# EAGLE design Bottle_PCB (EAGLE 7.1.0)
Assembly variants: BOM_CHECKED
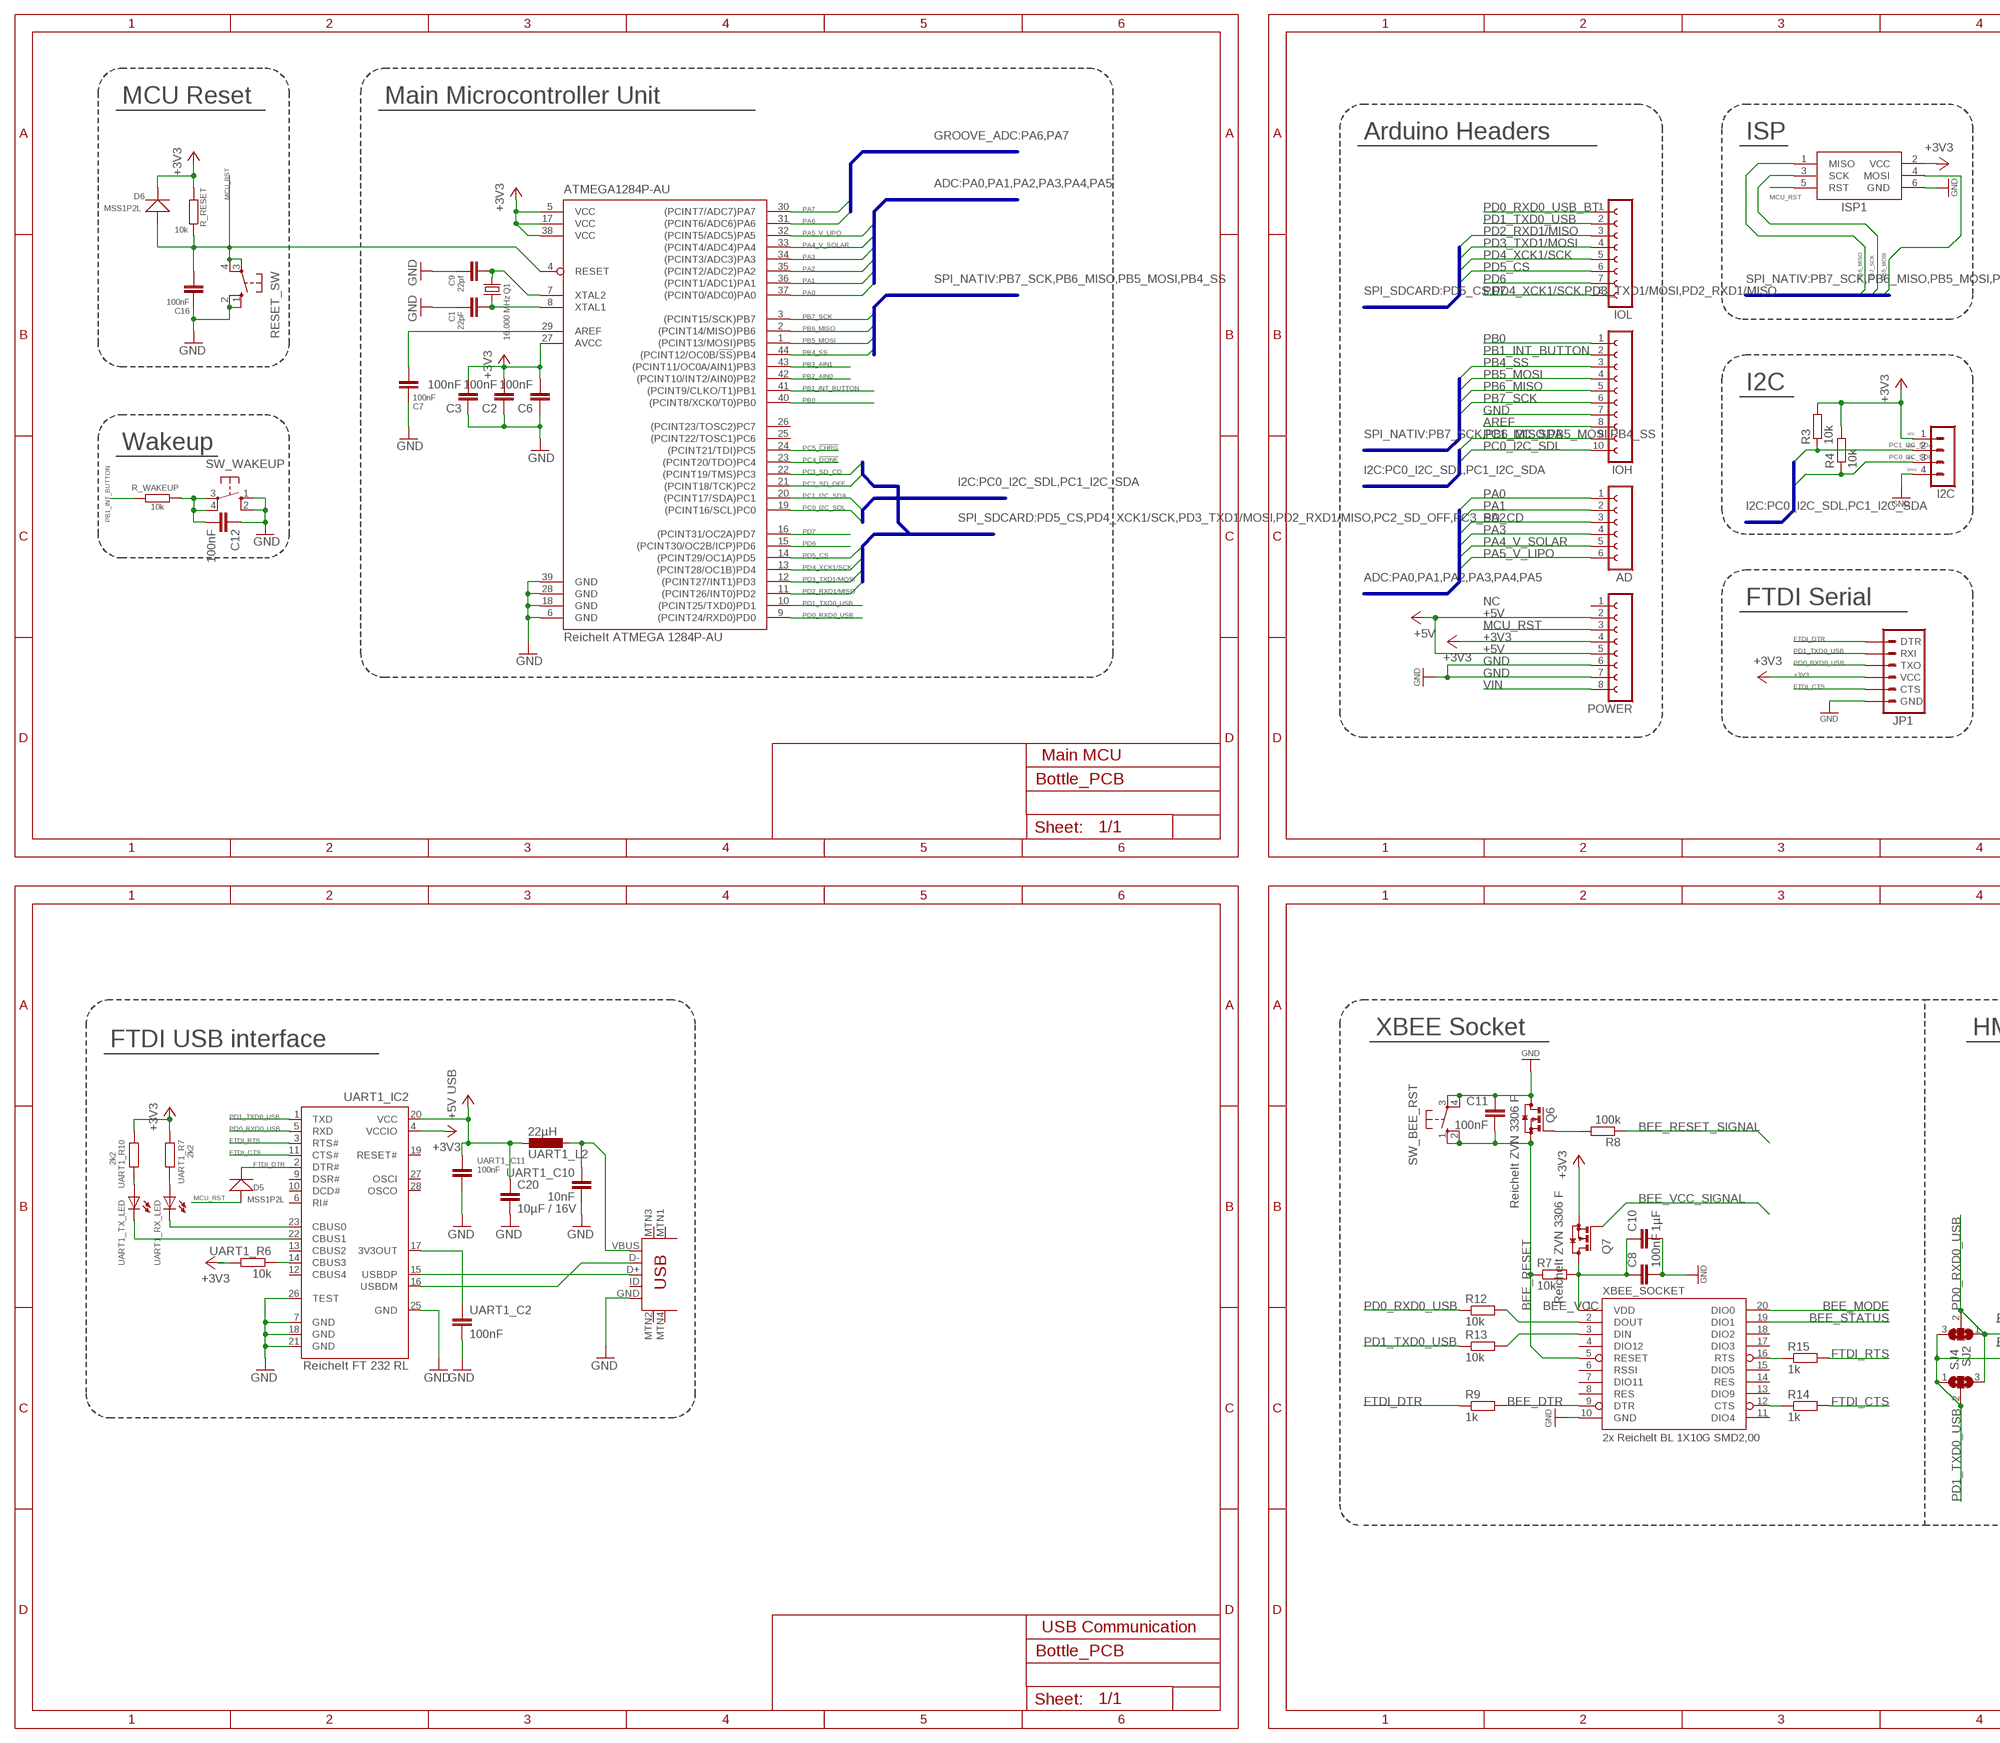
[diagram p0: schematic, sheet 1, part 1 of 2]
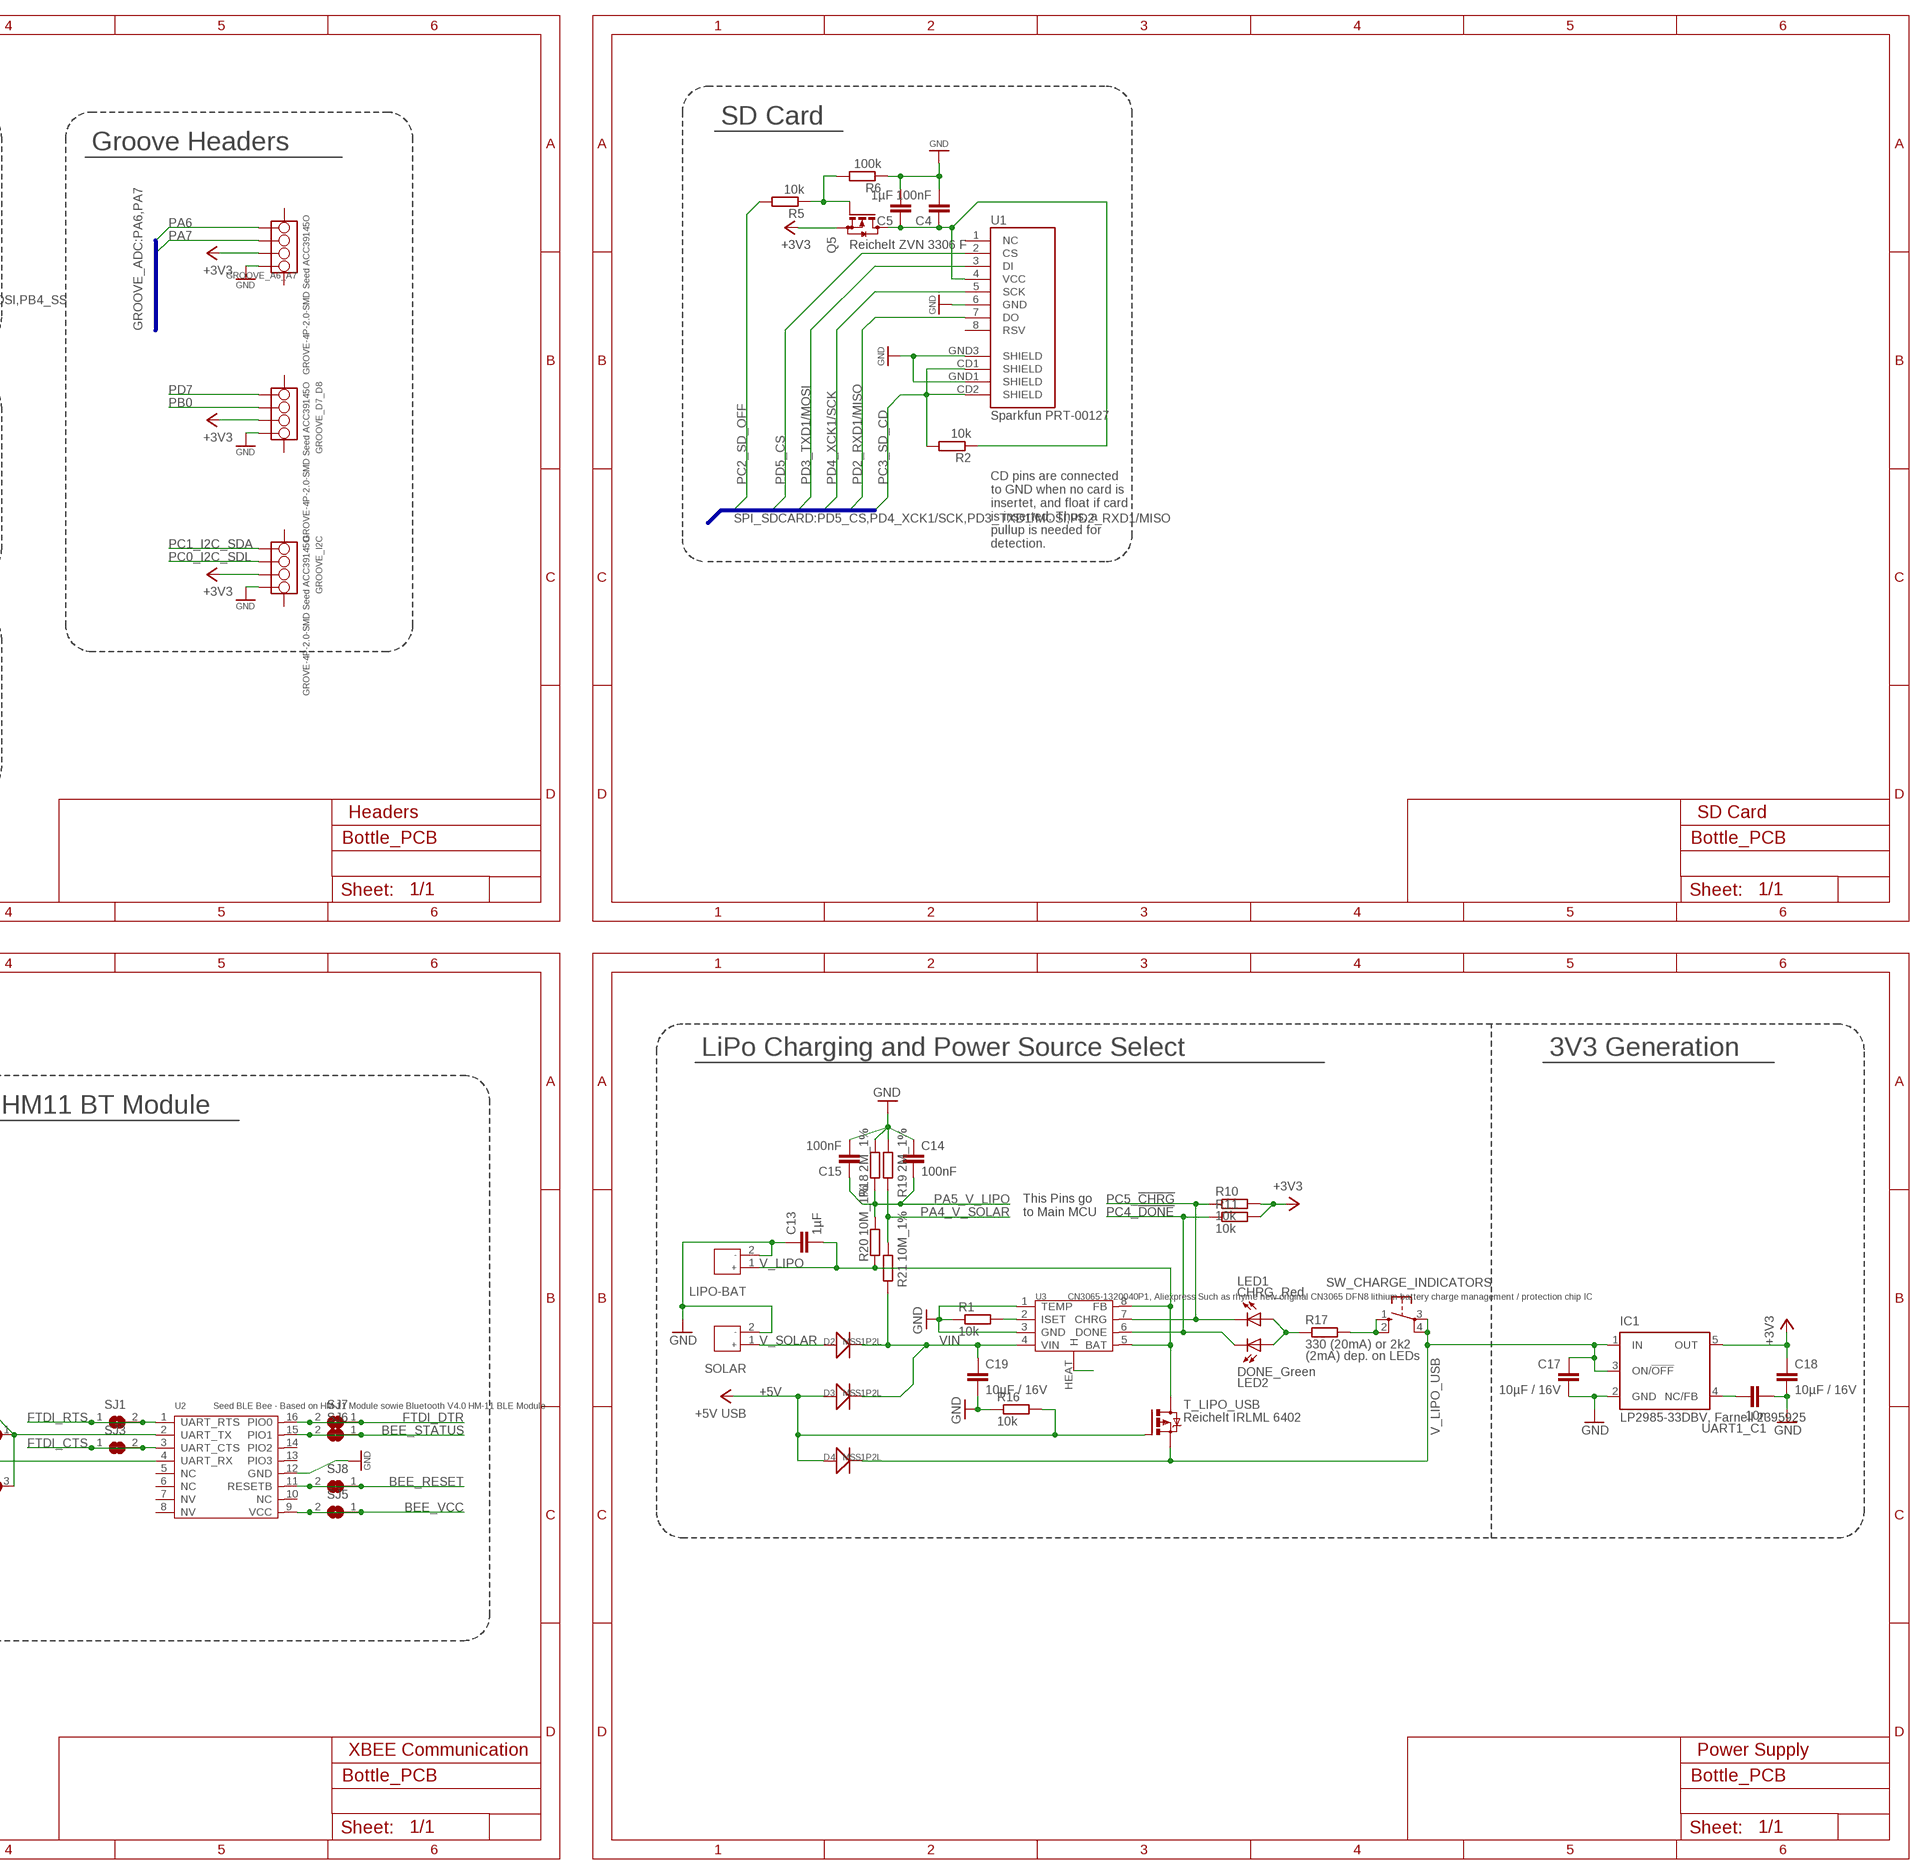
[diagram p1: schematic, sheet 1, part 2 of 2]

## Parts
AD  FE06-1  [FE06]  (variant BOM_CHECKED: Sparkfun PRT-11417 Part 1/4)
ATMEGA1284P-AU  Reichelt ATMEGA 1284P-AU  ATMEGA644A  [TQFP44]
C1  22pF  C-EUC0603  [C0603-ROUND]  (variant BOM_CHECKED: Reichelt NPO-G0603 22P)
C2  100nF  C-EUC0603  [C0603-ROUND]  (variant BOM_CHECKED: Reichelt X7R-G0603 100N)
C3  100nF  C-EUC0603  [C0603-ROUND]  (variant BOM_CHECKED: Reichelt X7R-G0603 100N)
C4  100nF  C-EUC0603  [C0603-ROUND]  (variant BOM_CHECKED: Reichelt X7R-G0603 100N)
C5  1µF  C-EUC1210  [C1210]  (variant BOM_CHECKED: Reichelt X7R-G1210 1,0)
C6  100nF  C-EUC0603  [C0603-ROUND]  (variant BOM_CHECKED: Reichelt X7R-G0603 100N)
C7  100nF  C-EUC0603  [C0603-ROUND]  (variant BOM_CHECKED: Reichelt X7R-G0603 100N)
C8  100nF  C-EUC0603  [C0603-ROUND]  (variant BOM_CHECKED: Reichelt X7R-G0603 100N)
C9  22pf  C-EUC0603  [C0603-ROUND]  (variant BOM_CHECKED: Reichelt NPO-G0603 22P)
C10  1µF  C-EUC1210  [C1210]  (variant BOM_CHECKED: Reichelt X7R-G1210 1,0)
C11  100nF  C-EUC0603  [C0603-ROUND]  (variant BOM_CHECKED: Reichelt X7R-G0603 100N)
C12  100nF  C-EUC0603  [C0603-ROUND]  (variant BOM_CHECKED: Reichelt X7R-G0603 100N)
C13  1µF  C-EUC1210  [C1210]  (variant BOM_CHECKED: Reichelt X7R-G1210 1,0)
C14  100nF  C-EUC0603  [C0603-ROUND]  (variant BOM_CHECKED: Reichelt X7R-G0603 100N)
C15  100nF  C-EUC0603  [C0603-ROUND]  (variant BOM_CHECKED: Reichelt X7R-G0603 100N)
C16  100nF  C-EUC0603  [C0603-ROUND]  (variant BOM_CHECKED: Reichelt X7R-G0603 100N)
C17  10µF / 16V  C-EUC0805  [C0805]  (variant BOM_CHECKED: Reichelt X5R-G0805 10/16)
C18  10µF / 16V  C-EUC0805  [C0805]  (variant BOM_CHECKED: Reichelt X5R-G0805 10/16)
C19  10µF / 16V  C-EUC0805  [C0805]  (variant BOM_CHECKED: Reichelt X5R-G0805 10/16)
C20  10µF / 16V  C-EUC0805  [C0805]  (variant BOM_CHECKED: Reichelt X5R-G0805 10/16)
D2  MSS1P2L  D1005  [D1005]  (variant BOM_CHECKED: DigiKey MSS1P2U)
D3  MSS1P2L  D1005  [D1005]  (variant BOM_CHECKED: DigiKey MSS1P2U)
D4  MSS1P2L  D1005  [D1005]  (variant BOM_CHECKED: DigiKey MSS1P2U)
D5  MSS1P2L  D1005  [D1005]  (variant BOM_CHECKED: DigiKey MSS1P2U)
D6  MSS1P2L  D1005  [D1005]  (variant BOM_CHECKED: DigiKey MSS1P2U)
GROOVE_A6_A7  GROVE-4P-2.0-SMD Seed ACC39145O  GROVE-4P-2.0-SMD-FEMALE-REINFORCE-3470090P1  [4P-SMD-2.0]
GROOVE_D7_D8  GROVE-4P-2.0-SMD Seed ACC39145O  GROVE-4P-2.0-SMD-FEMALE-REINFORCE-3470090P1  [4P-SMD-2.0]
GROOVE_I2C  GROVE-4P-2.0-SMD Seed ACC39145O  GROVE-4P-2.0-SMD-FEMALE-REINFORCE-3470090P1  [4P-SMD-2.0]
I2C  MA04-1  [MA04-1]  (variant BOM_CHECKED: Reichelt SL 1X36G 2,54, geteilt mit J1 reicht für jeweils 3 Boards)
IC1  LP2985-33DBV, Farnell 2395925  LP2985-XXDBVR33  [SOT23-DBV]
IOH  FE10-1  [FE10]  (variant BOM_CHECKED: Sparkfun PRT-11417 Part 2/4)
IOL  FE08-1  [FE08]  (variant BOM_CHECKED: Sparkfun PRT-11417 Part 3/4)
ISP1  Reichelt WSL 6G  AVRISP-6  [AVRISP]
JP1  ARDUINO_SERIAL_PROGRAMPTH  [1X06]  (variant BOM_CHECKED: siehe I2C)
LED1  CHRG_Red  LEDCHIPLED_0603  [CHIPLED_0603]  (variant BOM_CHECKED: Reichelt LS L29K)
LED2  DONE_Green  LEDCHIPLED_0603  [CHIPLED_0603]  (variant BOM_CHECKED: Reichelt LG L29K)
LIPO-BAT  JACK-JST-2P-PW2.0  [JST-2.0]  (variant BOM_CHECKED: Sparkfun PRT-00339 and Lipoly 2.5 mm JST XH-Style Shrouded Male Connector: 2-Pin, Straight (4-Pack) Pololu 2717)
POWER  FE08-1  [FE08]  (variant BOM_CHECKED: Sparkfun PRT-11417 Part 1/4)
Q1  16.000 MHz  CRYSTALHC49U-V  [HC49U-V]  (variant BOM_CHECKED: Reichelt 16,0000-HC49U-S)
Q5  Reichelt ZVN 3306 F  BSS123  [SOT23]
Q6  Reichelt ZVN 3306 F  BSS123  [SOT23]
Q7  Reichelt ZVN 3306 F  BSS123  [SOT23]
R1  10k  R-EU_R0603  [R0603-ROUND]  (variant BOM_CHECKED: Reichelt SMD-0603 10K)
R2  10k  R-EU_R0603  [R0603-ROUND]  (variant BOM_CHECKED: Reichelt SMD-0603 10K)
R3  10k  R-EU_R0603  [R0603-ROUND]  (variant BOM_CHECKED: Reichelt SMD-0603 10K)
R4  10k  R-EU_R0603  [R0603-ROUND]  (variant BOM_CHECKED: Reichelt SMD-0603 10K)
R5  10k  R-EU_R0603  [R0603-ROUND]  (variant BOM_CHECKED: Reichelt SMD-0603 10K)
R6  100k  R-EU_R0603  [R0603-ROUND]  (variant BOM_CHECKED: Reichelt SMD-0603 100K)
R7  10k  R-EU_R0603  [R0603-ROUND]  (variant BOM_CHECKED: Reichelt SMD-0603 10K)
R8  100k  R-EU_R0603  [R0603-ROUND]  (variant BOM_CHECKED: Reichelt SMD-0603 100K)
R9  1k  R-EU_R0603  [R0603-ROUND]  (variant BOM_CHECKED: Reichelt SMD-0603 1,0K)
R10  10k  R-EU_R0603  [R0603-ROUND]  (variant BOM_CHECKED: Reichelt SMD-0603 10K)
R11  10k  R-EU_R0603  [R0603-ROUND]  (variant BOM_CHECKED: Reichelt SMD-0603 10K)
R12  10k  R-EU_R0603  [R0603-ROUND]  (variant BOM_CHECKED: Reichelt SMD-0603 10K)
R13  10k  R-EU_R0603  [R0603-ROUND]  (variant BOM_CHECKED: Reichelt SMD-0603 10K)
R14  1k  R-EU_R0603  [R0603-ROUND]  (variant BOM_CHECKED: Reichelt SMD-0603 1,0K)
R15  1k  R-EU_R0603  [R0603-ROUND]  (variant BOM_CHECKED: Reichelt SMD-0603 1,0K)
R16  10k  R-EU_R0603  [R0603-ROUND]  (variant BOM_CHECKED: Reichelt SMD-0603 10K)
R17  330 (20mA) or 2k2  R-EU_R0603  [R0603-ROUND]  (variant BOM_CHECKED: Reichelt SMD-0603 2,2K)
R18  2M_1%  R-EU_R0603  [R0603-ROUND]  (variant BOM_CHECKED: Farnell 1469773RL)
R19  2M_1%  R-EU_R0603  [R0603-ROUND]  (variant BOM_CHECKED: Farnell 1469773RL)
R20  10M_1%  R-EU_R0603  [R0603-ROUND]  (variant BOM_CHECKED: Farnell 1469750)
R21  10M_1%  R-EU_R0603  [R0603-ROUND]  (variant BOM_CHECKED: Farnell 1469750)
R_RESET  10k  R-EU_R0603  [R0603-ROUND]  (variant BOM_CHECKED: Reichelt SMD-0603 10K)
R_WAKEUP  10k  R-EU_R0603  [R0603-ROUND]  (variant BOM_CHECKED: Reichelt SMD-0603 10K)
RESET_SW  10-XX  [B3F-10XX]  (variant BOM_CHECKED: Reichelt TASTER 3301)
SJ1  SJ  [SJ]
SJ2  SJ2W  [SJ_2]
SJ3  SJ  [SJ]
SJ4  SJ2W  [SJ_2]
SJ5  SJ  [SJ]
SJ6  SJ  [SJ]
SJ7  SJ  [SJ]
SJ8  SJ  [SJ]
SOLAR  JACK-JST-2P-PW2.0  [JST-2.0]  (variant BOM_CHECKED: Lipoly  0.5W Solar Panel 5,5V 55x70mm SeeedStudio POW112D2P o.ä. und  2.5 mm JST XH-Style Shrouded Male Connector: 2-Pin, Straight (4-Pack) Pololu 2717)
SW_BEE_RST  10-XX  [B3F-10XX]  (variant BOM_CHECKED: Reichelt TASTER 3301)
SW_CHARGE_INDICATORS  10-XX  [B3F-10XX]  (variant BOM_CHECKED: Reichelt TASTER 3301)
SW_WAKEUP  10-XX  [B3F-10XX]  (variant BOM_CHECKED: Reichelt TASTER 3301)
T_LIPO_USB  Reichelt IRLML 6402  MOS_P_SOT23_GDS  [SOT23]
U1  Sparkfun PRT-00127  USD-SOCKETNEW  [MICRO-SD-SOCKET-PP]
U2  Seed BLE Bee - Based on HM-11 Module sowie Bluetooth V4.0 HM-11 BLE Module  HM-11  [16P-18.5X13.5X0.8]
U3  CN3065-1320040P1, Aliexpress Such as rhyme new original CN3065 DFN8 lithium battery charge management / protection chip IC  CN3065-1320040P1  [DFN8]
UART1_C1  10n  C-EUC0603  [C0603-ROUND]  (variant BOM_CHECKED: Reichelt X7R-G0603 10N)
UART1_C2  100nF  C-EUC0603  [C0603-ROUND]  (variant BOM_CHECKED: Reichelt X7R-G0603 100N)
UART1_C10  10nF  C-EUC0603  [C0603-ROUND]  (variant BOM_CHECKED: Reichelt X7R-G0603 10N)
UART1_C11  100nF  C-EUC0603  [C0603-ROUND]  (variant BOM_CHECKED: Reichelt X7R-G0603 100N)
UART1_IC2  Reichelt FT 232 RL  FT232RL  [SSOP28]
UART1_L2  22µH  L-EUL1812  [L1812]  (variant BOM_CHECKED: Reichelt L-1812AS 22µ)
UART1_R6  10k  R-EU_R0603  [R0603-ROUND]  (variant BOM_CHECKED: Reichelt SMD-0603 10K)
UART1_R7  2k2  R-EU_R0603  [R0603-ROUND]  (variant BOM_CHECKED: Reichelt SMD-0603 2,2K)
UART1_R10  2k2  R-EU_R0603  [R0603-ROUND]  (variant BOM_CHECKED: Reichelt SMD-0603 2,2K)
UART1_RX_LED  LEDCHIPLED_0603  [CHIPLED_0603]  (variant BOM_CHECKED: Reichelt LS L29K)
UART1_TX_LED  LEDCHIPLED_0603  [CHIPLED_0603]  (variant BOM_CHECKED: Reichelt LG L29K)
USB_CONNECTOR  USB-MINIB-5PIN Sparkfun PRT-00587  USB-MINIB-5PIN  [USB-MINIB]
XBEE_SOCKET  2x Reichelt BL 1X10G SMD2,00  XBEE-1B3  [XBEE-SMD]

## Nets
+3V3: ATMEGA1284P-AU.5(VCC) ATMEGA1284P-AU.17(VCC) ATMEGA1284P-AU.27(AVCC) ATMEGA1284P-AU.38(VCC) C2.2 C3.2 C6.2 C18.1 D6.- GROOVE_A6_A7.2 GROOVE_D7_D8.2 GROOVE_I2C.2 I2C.1 IC1.5(OUT) ISP1.2(VCC) JP1.VCC POWER.4 Q5.2(S) Q7.2(S) R3.2 R4.2 R10.2 R11.2 R_RESET.2 UART1_IC2.4(VCCIO) UART1_R6.2 UART1_R7.1 UART1_R10.1
+5V: C20.1 D3.+ D4.+ POWER.2 POWER.5 R16.2 T_LIPO_USB.1(G) UART1_C11.1 UART1_IC2.20(VCC) UART1_L2.2 ; supply symbol labelled +5V USB
AREF: ATMEGA1284P-AU.29(AREF) C7.2 IOH.8
BEE_DTR: R9.2 XBEE_SOCKET.9(DTR)
BEE_MODE: XBEE_SOCKET.20(DIO0)
BEE_RESET: C11.2 Q6.2(S) R7.1 SJ8.1 SJ8.2 SW_BEE_RST.1(S) SW_BEE_RST.2(S1) U2.11(RESETB) XBEE_SOCKET.5(RESET)
BEE_RESET_SIGNAL: R8.1
BEE_STATUS: SJ6.1 SJ6.2 U2.15(PIO1) XBEE_SOCKET.19(DIO1)
BEE_VCC: C8.1 C10.1 Q7.3(D) R7.2 SJ5.1 SJ5.2 U2.9(VCC) XBEE_SOCKET.1(VDD)
BEE_VCC_SIGNAL: Q7.1(G)
FTDI_CTS: JP1.CTS R14.2 SJ3.1 SJ3.2 U2.3(UART_CTS) UART1_IC2.11(CTS#)
FTDI_DTR: D5.- JP1.DTR R9.1 SJ7.1 SJ7.2 U2.16(PIO0) UART1_IC2.2(DTR#)
FTDI_RTS: R15.2 SJ1.1 SJ1.2 U2.1(UART_RTS) UART1_IC2.3(RTS#)
GND: ATMEGA1284P-AU.6(GND) ATMEGA1284P-AU.18(GND) ATMEGA1284P-AU.28(GND) ATMEGA1284P-AU.39(GND) C1.1 C2.1 C3.1 C4.2 C5.2 C6.1 C7.1 C8.2 C9.1 C10.2 C11.1 C12.1 C13.1 C14.1 C15.2 C16.1 C17.2 C18.2 C19.2 C20.2 GROOVE_A6_A7.1 GROOVE_D7_D8.1 GROOVE_I2C.1 I2C.4 IC1.2(GND) IOH.7 ISP1.6(GND) JP1.GND LIPO-BAT.2 POWER.6 POWER.7 Q6.3(D) R1.1 R6.1 R16.1 R18.2 R19.2 RESET_SW.1(S) RESET_SW.2(S1) SOLAR.2 SW_BEE_RST.3(P) SW_BEE_RST.4(P1) SW_WAKEUP.1(S) SW_WAKEUP.2(S1) U1.6(GND) U1.GND1(SHIELD) U1.GND3(SHIELD) U2.12(GND) U3.1(TEMP) U3.3(GND) UART1_C1.2 UART1_C2.2 UART1_C10.2 UART1_C11.2 UART1_IC2.7(GND) UART1_IC2.18(GND) UART1_IC2.21(GND) UART1_IC2.25(GND) UART1_IC2.26(TEST) USB_CONNECTOR.GND XBEE_SOCKET.10(GND)
MCU_RST: ATMEGA1284P-AU.4(RESET) C16.2 D5.+ D6.+ ISP1.5(RST) POWER.3 R_RESET.1 RESET_SW.3(P) RESET_SW.4(P1)
N$1: UART1_R10.2 UART1_TX_LED.A
N$2: UART1_C2.1 UART1_IC2.17(3V3OUT)
N$3: IC1.4(NC/FB) UART1_C1.1
N$4: UART1_IC2.16(USBDM) USB_CONNECTOR.D-
N$5: R14.1 XBEE_SOCKET.12(CTS)
N$7: R15.1 XBEE_SOCKET.16(RTS)
N$8: R12.2 XBEE_SOCKET.2(DOUT)
N$9: UART1_R7.2 UART1_RX_LED.A
N$10: UART1_IC2.15(USBDP) USB_CONNECTOR.D+
N$11: UART1_IC2.14(CBUS3) UART1_R6.1
N$12: UART1_C10.1 UART1_L2.1 USB_CONNECTOR.VBUS
N$13: UART1_IC2.23(CBUS0) UART1_RX_LED.C
N$14: UART1_IC2.22(CBUS1) UART1_TX_LED.C
N$15: R13.2 XBEE_SOCKET.3(DIN)
N$16: C12.2 R_WAKEUP.1 SW_WAKEUP.3(P) SW_WAKEUP.4(P1)
N$18: LED1.A LED2.A R17.1
N$20: R17.2 SW_CHARGE_INDICATORS.1(S) SW_CHARGE_INDICATORS.2(S1)
N$22: R1.2 U3.2(ISET)
N$27: U3.HEAT(H)
N$31: C4.1 C5.1 Q5.3(D) R2.1 U1.4(VCC)
N$33: Q5.1(G) R5.1 R6.2
N$34: Q6.1(G) R8.2
PA0: AD.1 ATMEGA1284P-AU.37((PCINT0/ADC0)PA0)
PA1: AD.2 ATMEGA1284P-AU.36((PCINT1/ADC1)PA1)
PA2: AD.3 ATMEGA1284P-AU.35((PCINT2/ADC2)PA2)
PA3: AD.4 ATMEGA1284P-AU.34((PCINT3/ADC3)PA3)
PA4_V_SOLAR: AD.5 ATMEGA1284P-AU.33((PCINT4/ADC4)PA4) R19.1 R21.2
PA5_V_LIPO: AD.6 ATMEGA1284P-AU.32((PCINT5/ADC5)PA5) C14.2 C15.1 R18.1 R20.2
PA6: ATMEGA1284P-AU.31((PCINT6/ADC6)PA6) GROOVE_A6_A7.4
PA7: ATMEGA1284P-AU.30((PCINT7/ADC7)PA7) GROOVE_A6_A7.3
PB0: ATMEGA1284P-AU.40((PCINT8/XCK0/T0)PB0) GROOVE_D7_D8.3 IOH.1
PB1_INT_BUTTON: ATMEGA1284P-AU.41((PCINT9/CLKO/T1)PB1) IOH.2
PB2_AIN0: ATMEGA1284P-AU.42((PCINT10/INT2/AIN0)PB2)
PB3_AIN1: ATMEGA1284P-AU.43((PCINT11/OC0A/AIN1)PB3)
PB4_SS: ATMEGA1284P-AU.44((PCINT12/OC0B/!SS!)PB4) IOH.3
PB5_MOSI: ATMEGA1284P-AU.1((PCINT13/MOSI)PB5) IOH.4 ISP1.4(MOSI)
PB6_MISO: ATMEGA1284P-AU.2((PCINT14/MISO)PB6) IOH.5 ISP1.1(MISO)
PB7_SCK: ATMEGA1284P-AU.3((PCINT15/SCK)PB7) IOH.6 ISP1.3(SCK)
PC0_I2C_SDL: ATMEGA1284P-AU.19((PCINT16/SCL)PC0) GROOVE_I2C.3 I2C.3 IOH.10 R4.1
PC1_I2C_SDA: ATMEGA1284P-AU.20((PCINT17/SDA)PC1) GROOVE_I2C.4 I2C.2 IOH.9 R3.1
PC2_SD_OFF: ATMEGA1284P-AU.21((PCINT18/TCK)PC2) R5.2
PC3_SD_CD: ATMEGA1284P-AU.22((PCINT19/TMS)PC3) R2.2 U1.CD1(SHIELD) U1.CD2(SHIELD)
PC4_!DONE: ATMEGA1284P-AU.23((PCINT20/TDO)PC4) LED2.C R11.1 U3.6(DONE)
PC5_!CHRG: ATMEGA1284P-AU.24((PCINT21/TDI)PC5) LED1.C R10.1 U3.7(CHRG)
PD0_RXD0_USB: ATMEGA1284P-AU.9((PCINT24/RXD0)PD0) JP1.TXO R12.1 SJ2.1 SJ2.2 SJ4.3 U2.2(UART_TX) UART1_IC2.5(RXD)
PD0_RXD0_USB_BT: IOL.1
PD1_TXD0_USB: ATMEGA1284P-AU.10((PCINT25/TXD0)PD1) IOL.2 JP1.RXI R13.1 SJ2.3 SJ4.1 SJ4.2 U2.4(UART_RX) UART1_IC2.1(TXD)
PD2_RXD1/MISO: ATMEGA1284P-AU.11((PCINT26/INT0)PD2) IOL.3 U1.7(DO)
PD3_TXD1/MOSI: ATMEGA1284P-AU.12((PCINT27/INT1)PD3) IOL.4 U1.3(DI)
PD4_XCK1/SCK: ATMEGA1284P-AU.13((PCINT28/OC1B)PD4) IOL.5 U1.5(SCK)
PD5_CS: ATMEGA1284P-AU.14((PCINT29/OC1A)PD5) IOL.6 U1.2(CS)
PD6: ATMEGA1284P-AU.15((PCINT30/OC2B/ICP)PD6) IOL.7
PD7: ATMEGA1284P-AU.16((PCINT31/OC2A)PD7) GROOVE_D7_D8.4 IOL.8
V_LIPO: C13.2 LIPO-BAT.1 R20.1 T_LIPO_USB.2(D) U3.5(BAT) U3.8(FB)
V_LIPO_USB: C17.1 D4.- IC1.1(IN) IC1.3(ON/!OFF) SW_CHARGE_INDICATORS.3(P) SW_CHARGE_INDICATORS.4(P1) T_LIPO_USB.3(S)
V_SOLAR: D2.+ SOLAR.1
VIN: C19.1 D2.- D3.- POWER.8 R21.1 U3.4(VIN)
XTAL1: ATMEGA1284P-AU.8(XTAL1) C1.2 Q1.1
XTAL2: ATMEGA1284P-AU.7(XTAL2) C9.2 Q1.2
Unconnected: ATMEGA1284P-AU.25((PCINT22/TOSC1)PC6) ATMEGA1284P-AU.26((PCINT23/TOSC2)PC7) GROOVE_A6_A7.SS1 GROOVE_A6_A7.SS2 GROOVE_D7_D8.SS1 GROOVE_D7_D8.SS2 GROOVE_I2C.SS1 GROOVE_I2C.SS2 POWER.1 R_WAKEUP.2 U1.1(NC) U1.8(RSV) U2.5(NC) U2.6(NC) U2.7(NV) U2.8(NV) U2.10(NC) U2.13(PIO3) U2.14(PIO2) UART1_IC2.6(RI#) UART1_IC2.9(DSR#) UART1_IC2.10(DCD#) UART1_IC2.12(CBUS4) UART1_IC2.13(CBUS2) UART1_IC2.19(RESET#) UART1_IC2.27(OSCI) UART1_IC2.28(OSCO) USB_CONNECTOR.ID USB_CONNECTOR.MTN1(MTN2) USB_CONNECTOR.MTN2(MTN3) USB_CONNECTOR.MTN3(MTN1) USB_CONNECTOR.MTN4 XBEE_SOCKET.4(DIO12) XBEE_SOCKET.6(RSSI) XBEE_SOCKET.7(DIO11) XBEE_SOCKET.8(RES) XBEE_SOCKET.11(DIO4) XBEE_SOCKET.13(DIO9) XBEE_SOCKET.14(RES) XBEE_SOCKET.15(DIO5) XBEE_SOCKET.17(DIO3) XBEE_SOCKET.18(DIO2)

## Buses
SPI_NATIV:PB7_SCK,PB6_MISO,PB5_MOSI,PB4_SS
SPI_SDCARD:PD5_CS,PD4_XCK1/SCK,PD3_TXD1/MOSI,PD2_RXD1/MISO
I2C:PC0_I2C_SDL,PC1_I2C_SDA
ADC:PA0,PA1,PA2,PA3,PA4,PA5
GROOVE_ADC:PA6,PA7
SPI_SDCARD:PD5_CS,PD4_XCK1/SCK,PD3_TXD1/MOSI,PD2_RXD1/MISO,PC2_SD_OFF,PC3_SD_CD

## Notes on the sheet
- MCU Reset | Main Microcontroller Unit
- SD Card
- Arduino Headers | ISP | Groove Headers
- (TCK) | (TMS) | (TDO) | (TDI) | (RESET) | (SCK) | (PDI/MOSI) | (PDO/MISO)
- I2C
- VCC
- CD pins are connected
  to GND when no card is
  insertet, and float if card
  is inserted. Thus, a
  pullup is needed for
  detection.
- SDA
- Wakeup
- SCL
- GND
- NC | FTDI Serial
- (TCK) | (TMS) | (TDO) | (TDI) | (RESET) | (SCK) | (PDI/MOSI) | (PDO/MISO)
- Main MCU | Headers | SD Card
- LiPo Charging and Power Source Select | 3V3 Generation
- XBEE Socket | HM11 BT Module
- FTDI USB interface
- This Pins go
  to Main MCU
- (2mA) dep. on LEDs
- USB Communication | XBEE Communication | Power Supply

## Library data of the parts
AD = con-lsta:FE06-1: FEMALE HEADER; OC_FARNELL: unknown; OC_NEWARK: unknown
ATMEGA1284P-AU = atmel:ATMEGA644: 8-bit Microcontroller with 64K Bytes In-System Programmable Flash Source: http://www.atmel.com/dyn/resources/prod_documents/doc2593.pdf; MPN: ATMEGA644PV-10AU; OC_FARNELL: 1455123; OC_NEWARK: 58M3748
C1-C20 UART1_C1 UART1_C2 UART1_C10 UART1_C11 = Arduino-SmartPrj:C-EU: CAPACITOR, European symbol
D2-D6 = Seed-Discrete:D*
GROOVE_A6_A7 GROOVE_D7_D8 GROOVE_I2C = OPL:GROVE-4P-2.0-SMD-FEMALE-REINFORCE
I2C = con-lstb:MA04-1: PIN HEADER; OC_FARNELL: unknown; OC_NEWARK: unknown
IC1 = Arduino-SmartPrj:LP2985-XXDBVR: ULTRALOW-POWER 50-mA LOW-DROPOUT LINEAR REGULATORS 50-mA Low-Dropout Regulator Source: http://focus.ti.com/lit/ds/symlink/tps77001.pdf
IOH = con-lsta:FE10-1: FEMALE HEADER; OC_FARNELL: unknown; OC_NEWARK: unknown
IOL POWER = con-lsta:FE08-1: FEMALE HEADER; OC_FARNELL: unknown; OC_NEWARK: unknown
ISP1 = adafruit:AVRISP: AVR ISP HEADER Standard 6 pin header for AVR programming
JP1 = SparkFun-Connectors:ARDUINO_SERIAL_PROGRAM: FTDI connector footprints
LED1 LED2 UART1_RX_LED UART1_TX_LED = led:LED: LED OSRAM: - CHIPLED LG R971, LG N971, LY N971, LG Q971, LY Q971, LO R971, LY R971 LH N974, LH R974 LS Q976, LO Q976, LY Q976 LO Q996 - Hyper CHIPLED LW Q18S LB Q993, LB Q99A, LB R99A - SideLED LS A670, LO A670, LY A670, LG A670, LP A670 LB A673, LV A673, LT A673, LW A673 LH A674 LY A675 LS A676, LA A676, LO A676, LY A676, LW A676 LS A679, LY A679, LG A679 - Hyper Micro SIDELED® LS Y876, LA Y876, LO Y876, LY Y876 LT Y87S - SmartLED LW L88C, LW L88S LB L89C, LB L89S, LG L890 LS L89K, LO L89K, LY L89K LS L896, LA L896, LO L896, LY L896 - TOPLED LS T670, LO T670, LY T670, LG T670, LP T670 LSG T670, LSP T670, LSY T670, LOP T670, LYG T670 LG T671, LOG T671, LSG T671 LB T673, LV T673, LT T673, LW T673 LH T674 LS T676, LA T676, LO T676, LY T676, LB T676, LH T676, LSB T676, LW T676 LB T67C, LV T67C, LT T67C, LS T67K, LO T67K, LY T67K, LW E67C LS E67B, LA E67B, LO E67B, LY E67B, LB E67C, LV E67C, LT E67C LW T67C LS T679, LY T679, LG T679 LS T770, LO T770, LY T770, LG T770, LP T770 LB T773, LV T773, LT T773, LW T773 LH T774 LS E675, LA E675, LY E675, LS T675 LS T776, LA T776, LO T776, LY T776, LB T776 LHGB T686 LT T68C, LB T68C - Hyper Mini TOPLED® LB M676 - Mini TOPLED Santana® LG M470 LS M47K, LO M47K, LY M47K Source: http://www.osram.convergy.de LUXEON: - LUMILED® LXK2-PW12-R00, LXK2-PW12-S00, LXK2-PW14-U00, LXK2-PW14-V00 LXK2-PM12-R00, LXK2-PM12-S00, LXK2-PM14-U00 LXK2-PE12-Q00, LXK2-PE12-R00, LXK2-PE12-S00, LXK2-PE14-T00, LXK2-PE14-U00 LXK2-PB12-K00, LXK2-PB12-L00, LXK2-PB12-M00, LXK2-PB14-N00, LXK2-PB14-P00, LXK2-PB14-Q00 LXK2-PR12-L00, LXK2-PR12-M00, LXK2-PR14-Q00, LXK2-PR14-R00 LXK2-PD12-Q00, LXK2-PD12-R00, LXK2-PD12-S00 LXK2-PH12-R00, LXK2-PH12-S00 LXK2-PL12-P00, LXK2-PL12-Q00, LXK2-PL12-R00 Source: www.luxeon.com KINGBRIGHT: KA-3528ASYC Source: www.kingbright.com
LIPO-BAT SOLAR = Seed-Battery-Connector:JACK-JST-2P-PW
Q1 = crystal:CRYSTAL: CRYSTAL; OC_FARNELL: 1666969; OC_NEWARK: unknown
Q5-Q7 = transistor-small-signal:BSS123: N-CHANNEL MOS FET
R1-R21 R_RESET R_WAKEUP UART1_R6 UART1_R7 UART1_R10 = Arduino-SmartPrj:R-EU_: RESISTOR, European symbol
RESET_SW SW_BEE_RST SW_CHARGE_INDICATORS SW_WAKEUP = switch-omron:10-XX: OMRON SWITCH; MPN: B3F-1000; OC_FARNELL: 176432; OC_NEWARK: 36M3542
SJ1 SJ3 SJ5-SJ8 = jumper:SJ: SMD solder JUMPER
SJ2 SJ4 = jumper:SJ2W: SMD solder JUMPER
T_LIPO_USB = _transistor:MOS_P: P - CHANNEL ENHANCEMENT MODE (POWER ) MOS TRANSISTOR Name Package VDS ID PD RDS(on) VGS ttd(on) tr ttd(off) tf IRF9530 TO220_GDS -100V 12A 75W 0.3Ω ±20V 30ns 70ns 70ns 70ns FDN360P SOT23_GDS -30V -2.0A 0.5W 0.1Ω ±20V 6ns 13ns 11ns 6ns
U1 = SparkFun-Connectors:USD-SOCKET: microSD Socket Push-push type uSD socket. Schematic element and footprint production proven. Spark Fun Electronics SKU : PRT-00127. tDoc lines correctly indicate media card edge positions when inserting (unlocked, locked, depressed).
U2 = Seed-HM11:HM-11: Bluetooth Specification V4.0 BLE
U3 = OPL:CN3065: USB-Compatible Lithiumt-Ion Battery Charger with Thermal Regulation http://www.consonance-elec.com/pdf/%E6%8A%80%E6%9C%AF%E8%AF%B4%E6%98%8E%E4%B9%A6/DSC-CN3065.pdf
UART1_IC2 = FTDI:FT232R: Source: http://www.ftdichip.com/Documents/DataSheets/DS_FT232R_v104.pdf
UART1_L2 = rcl:L-EU: INDUCTOR, European symbol
USB_CONNECTOR = SparkFun-Connectors:USB-MINIB: Mini-USB "B" connector with 5th pin broken out. Created new symbol breaking out 5th "ID" pin in mini/micro USB connector spec. See: http://en.wikipedia.org/wiki/Mini_usb#Cables. Uses same footprint as 4-pin symbol. Also added pins to connect to mounting / shield pads if required (probably not generally needed as signals aren't shielded once they leave the connector).
XBEE_SOCKET = SparkFun-RF:XBEE-1: Xbee module footprints SMT header is CONN-09042.; PROD_ID: CONN-09042

## Board
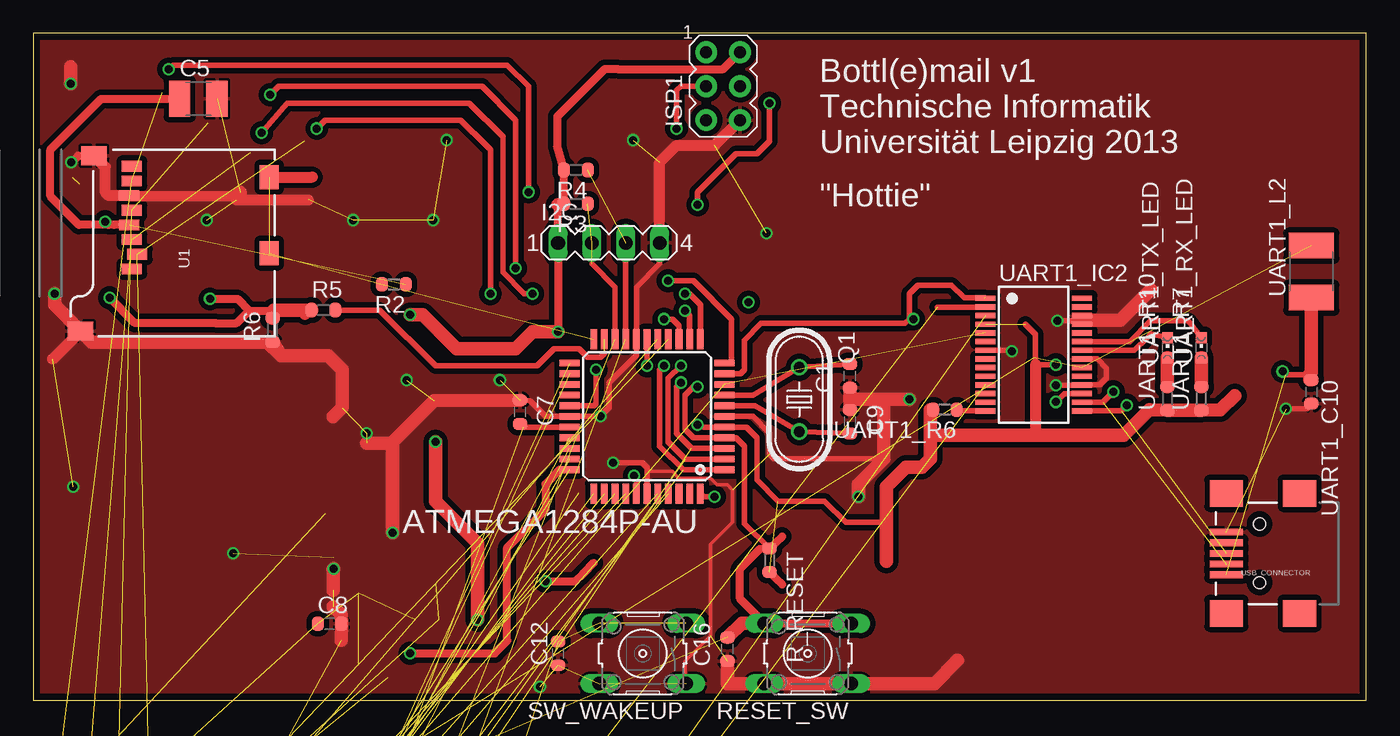
[diagram p2: board, top side]
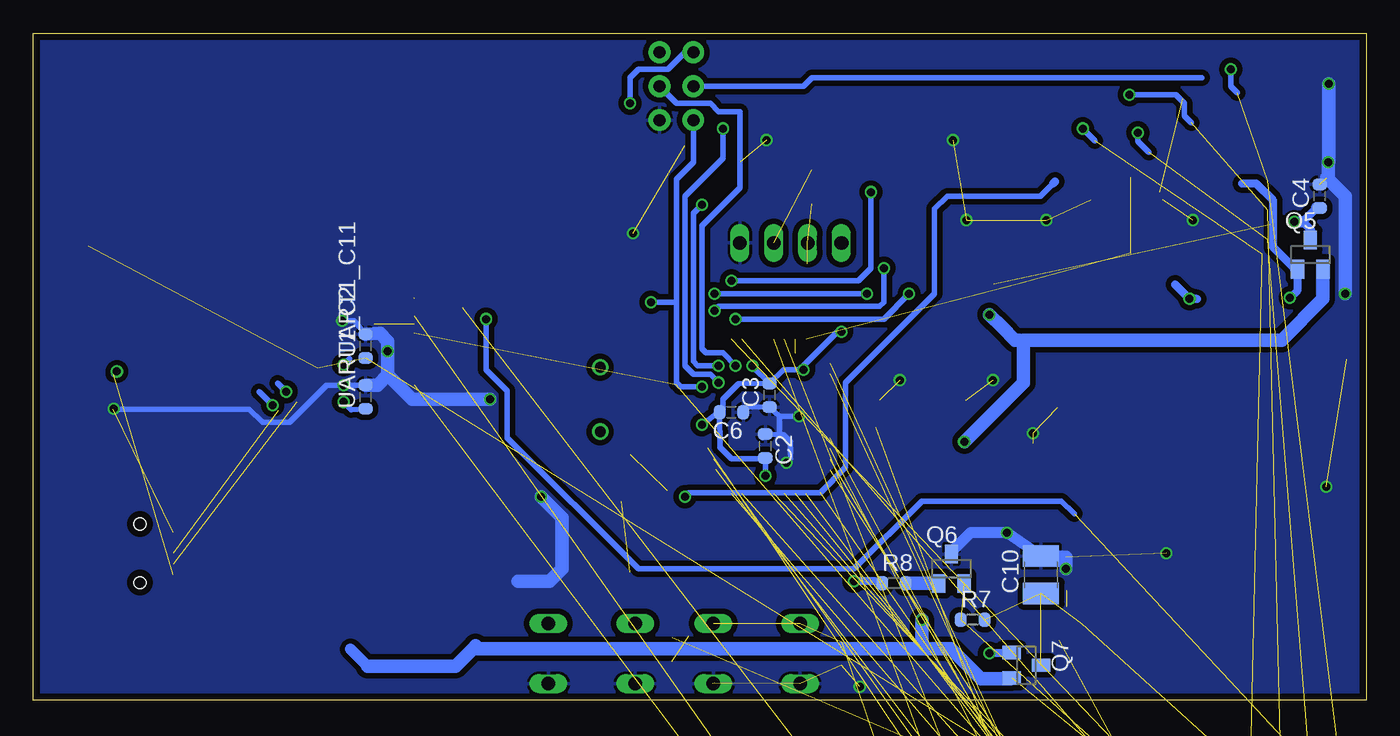
[diagram p3: board, bottom side, seen from below]

Size 100 x 50 mm. Coordinates in mm from the lower left corner, seen from the top.
Outline: 0,0 100,0 100,50 0,50 0,0
Copper layers (1*16): Top 0.035mm / dielectric 1.5mm / Bottom 0.035mm
Design rules "Eagle-DRU - 1203 - LeitOn - 01 and 02 layers": minimum track width 6mil, minimum drill 0.3mm, track to track 6mil, track to pad 6mil, pad to pad 6mil, via to via 6mil, smd to smd 6mil, copper to edge 20mil, drill to drill 10mil, minimum pad ring 8mil, minimum via ring 6mil, stop-mask expansion 3mil, vias tented up to drill 0mil, thermal gap 8mil

### Footprints (pad centres in the part's own frame; a part is rotated, then mirrored left to right if it is on the bottom)
FE06 = drill 0.813 long: 1 -6.35,0; 2 -3.81,0; 3 -1.27,0; 4 1.27,0; 5 3.81,0; 6 6.35,0
TQFP44 = smd 1.5 x 0.5: 1 -5.8,4; 2 -5.8,3.2; 3 -5.8,2.4; 4 -5.8,1.6; 5 -5.8,0.8; 6 -5.8,0; 7 -5.8,-0.8; 8 -5.8,-1.6; 9 -5.8,-2.4; 10 -5.8,-3.2; 11 -5.8,-4; 23 5.8,-4; 24 5.8,-3.2; 25 5.8,-2.4; 26 5.8,-1.6; 27 5.8,-0.8; 28 5.8,0; 29 5.8,0.8; 30 5.8,1.6; 31 5.8,2.4; 32 5.8,3.2; 33 5.8,4 | smd 0.5 x 1.5: 12 -4,-5.8; 13 -3.2,-5.8; 14 -2.4,-5.8; 15 -1.6,-5.8; 16 -0.8,-5.8; 17 0,-5.8; 18 0.8,-5.8; 19 1.6,-5.8; 20 2.4,-5.8; 21 3.2,-5.8; 22 4,-5.8; 34 4,5.8; 35 3.2,5.8; 36 2.4,5.8; 37 1.6,5.8; 38 0.8,5.8; 39 0,5.8; 40 -0.8,5.8; 41 -1.6,5.8; 42 -2.4,5.8; 43 -3.2,5.8; 44 -4,5.8
C0603-ROUND = smd 0.898 x 1.1: 1 -0.889,0; 2 0.889,0
C1210 = smd 1.6 x 2.7: 1 -1.4,0; 2 1.4,0
C0805 = smd 1.3 x 1.5: 1 -0.85,0; 2 0.85,0
D1005 = smd 1.016 x 1.016: + -1.27,0 | smd 1.778 x 1.143: - 0.889,0
4P-SMD-2.0 = smd 0.965 x 2.54: 1 -3,0; 2 -1,0; 3 1,0; 4 3,0 | smd 2.032 x 2.184: SS1 -5.946,3.4; SS2 5.946,3.4
MA04-1 = drill 1.016 long: 1 -3.81,0; 2 -1.27,0; 3 1.27,0; 4 3.81,0
SOT23-DBV = smd 0.55 x 1.2: 1 -0.95,-1.3; 2 0,-1.3; 3 0.95,-1.3; 4 0.95,1.3; 5 -0.95,1.3
FE10 = drill 0.813 long: 1 -11.43,0; 2 -8.89,0; 3 -6.35,0; 4 -3.81,0; 5 -1.27,0; 6 1.27,0; 7 3.81,0; 8 6.35,0; 9 8.89,0; 10 11.43,0
FE08 = drill 0.813 long: 1 -8.89,0; 2 -6.35,0; 3 -3.81,0; 4 -1.27,0; 5 1.27,0; 6 3.81,0; 7 6.35,0; 8 8.89,0
AVRISP = drill 0.9 pad 1.626: 1 -1.27,2.54; 2 1.27,2.54; 3 -1.27,0; 4 1.27,0; 5 -1.27,-2.54; 6 1.27,-2.54
1X06 = drill 1.016 pad 1.88: CTS 10.16,0; DTR 0,0; GND 12.7,0; RXI 2.54,0; TXO 5.08,0; VCC 7.62,0
CHIPLED_0603 = smd 0.8 x 0.8: A 0,-0.75; C 0,0.75
JST-2.0 = drill 0.8 pad 1.3 square: 1 -1,0.75 | drill 0.8 pad 1.3: 2 1,0.75
HC49U-V = drill 0.813: 1 -2.413,0; 2 2.413,0
SOT23 = smd 1 x 1.4: 1 -0.95,-1.1; 2 0.95,-1.1; 3 0,1.1
R0603-ROUND = smd 0.898 x 1.1: 1 -0.889,0; 2 0.889,0
B3F-10XX = drill 1.016 long: 1 -3.251,2.261; 2 3.251,2.261; 3 -3.251,-2.261; 4 3.251,-2.261
SJ = smd 1.168 x 1.6: 1 -0.762,0; 2 0.762,0
SJ_2 = smd 1.168 x 1.6: 1 -1.524,0; 2 0,0; 3 1.524,0
MICRO-SD-SOCKET-PP = smd 0.8 x 1.5: 1 -8.94,10.7; 2 -7.84,10.3; 3 -6.74,10.7; 4 -5.64,10.9; 5 -4.54,10.7; 6 -3.44,10.9; 7 -2.34,10.7; 8 -1.24,10.7 | smd 1.8 x 1.4: CD1 -2.05,0.4; CD2 -7.75,0.4 | smd 1.4 x 1.9: GND1 -13.6,14.55; GND3 -0.45,13.55
16P-18.5X13.5X0.8 = smd 1.7 x 1: 1 -6.6,2.15; 2 -6.6,0.65; 3 -6.6,-0.85; 4 -6.6,-2.35; 5 -6.6,-3.85; 6 -6.6,-5.35; 7 -6.6,-6.85; 8 -6.6,-8.35; 9 6.6,-8.35; 10 6.6,-6.85; 11 6.6,-5.35; 12 6.6,-3.85; 13 6.6,-2.35; 14 6.6,-0.85; 15 6.6,0.65; 16 6.6,2.15
DFN8 = smd 0.854 x 0.3: 1 -1.477,0.75; 2 -1.477,0.25; 3 -1.477,-0.25; 4 -1.477,-0.75; 5 1.477,-0.75; 6 1.477,-0.25; 7 1.477,0.25; 8 1.477,0.75 | smd 1.397 x 2.413: HEAT 0,0
SSOP28 = smd 0.4 x 1.5: 1 -4.225,-3.625; 2 -3.575,-3.625; 3 -2.925,-3.625; 4 -2.275,-3.625; 5 -1.625,-3.625; 6 -0.975,-3.625; 7 -0.325,-3.625; 8 0.325,-3.625; 9 0.975,-3.625; 10 1.625,-3.625; 11 2.275,-3.625; 12 2.925,-3.625; 13 3.575,-3.625; 14 4.225,-3.625; 15 4.225,3.625; 16 3.575,3.625; 17 2.925,3.625; 18 2.275,3.625; 19 1.625,3.625; 20 0.975,3.625; 21 0.325,3.625; 22 -0.325,3.625; 23 -0.975,3.625; 24 -1.625,3.625; 25 -2.275,3.625; 26 -2.925,3.625; 27 -3.575,3.625; 28 -4.225,3.625
L1812 = smd 1.9 x 3.4: 1 -1.95,0; 2 1.95,0
USB-MINIB = smd 2.5 x 0.5: D+ 2.5,0; D- 2.5,0.8; GND 2.5,-1.6; ID 2.5,-0.8; VBUS 2.5,1.6 | smd 2.5 x 2: MTN1 -3,4.5; MTN2 2.5,4.5; MTN3 -3,-4.5; MTN4 2.5,-4.5 | hole 0.9: 0,2.2; 0,-2.2
XBEE-SMD = smd 1.7 x 0.85: 1 -12.5,20; 2 -9.5,18; 3 -12.5,16; 4 -9.5,14; 5 -12.5,12; 6 -9.5,10; 7 -12.5,8; 8 -9.5,6; 9 -12.5,4; 10 -9.5,2; 11 12.5,2; 12 9.5,4; 13 12.5,6; 14 9.5,8; 15 12.5,10; 16 9.5,12; 17 12.5,14; 18 9.5,16; 19 12.5,18; 20 9.5,20

### Placement (x,y rotation side)
AD  3,-35 0 top  (outside the outline)
ATMEGA1284P-AU  46.04,21.27 180 top
C1  61.26,24.31 90 top
C2  45.09,19.05 270 bottom
C3  44.77,22.86 90 bottom
C4  3.49,37.78 90 bottom
C5  12.38,45.09 0 top
C6  47.62,21.59 180 bottom
C7  36.51,21.59 270 top
C8  22.23,5.71 0 top
C9  61.26,20.88 270 top
C10  24.4,9.4 90 bottom
C11  -31,-92 0 top  (outside the outline)
C12  39.37,3.49 90 top
C13  -47,-183 0 top  (outside the outline)
C14  -68,-264 0 top  (outside the outline)
C15  -68,-268 0 top  (outside the outline)
C16  52.07,3.81 90 top
C17  -68,-330 0 top  (outside the outline)
C18  -68,-334 0 top  (outside the outline)
C19  -68,-338 0 top  (outside the outline)
C20  -68,-342 0 top  (outside the outline)
D2  -46,-189 0 top  (outside the outline)
D3  -46,-192 0 top  (outside the outline)
D4  -46,-195 0 top  (outside the outline)
D5  -67,-319 0 top  (outside the outline)
D6  -67,-324 0 top  (outside the outline)
GROOVE_A6_A7  2,-50 0 top  (outside the outline)
GROOVE_D7_D8  2,-59 0 top  (outside the outline)
GROOVE_I2C  2,-68 0 top  (outside the outline)
I2C  43.18,34.29 0 top
IC1  -67,-275 0 top  (outside the outline)
IOH  8,-41 0 top  (outside the outline)
IOL  5,-11 0 top  (outside the outline)
ISP1  51.75,46.04 0 top
JP1  -31,-99 0 top  (outside the outline)
LED1  -52,-224 0 top  (outside the outline)
LED2  -57,-224 0 top  (outside the outline)
LIPO-BAT  -45,-169 0 top  (outside the outline)
POWER  5,-17 0 top  (outside the outline)
Q1  57.47,22.54 270 top
Q5  4.19,33.4 0 bottom
Q6  31.11,9.84 0 bottom
Q7  25.5,2.6 270 bottom
R1  -47,-164 0 top  (outside the outline)
R2  27.05,31.18 180 top
R3  40.7,37.21 180 top
R4  40.7,39.75 180 top
R5  21.77,29.25 0 top
R6  17.95,27.75 90 top
R7  29.53,6.03 0 bottom
R8  35.43,8.76 0 bottom
R9  -31,-103 0 top  (outside the outline)
R10  -68,-234 0 top  (outside the outline)
R11  -68,-239 0 top  (outside the outline)
R12  -31,-73 0 top  (outside the outline)
R13  -31,-77 0 top  (outside the outline)
R14  -31,-109 0 top  (outside the outline)
R15  -31,-115 0 top  (outside the outline)
R16  -47,-224 0 top  (outside the outline)
R17  -57,-229 0 top  (outside the outline)
R18  -68,-244 0 top  (outside the outline)
R19  -68,-249 0 top  (outside the outline)
R20  -68,-254 0 top  (outside the outline)
R21  -68,-259 0 top  (outside the outline)
R_RESET  55.24,10.48 270 top
R_WAKEUP  -68,-314 0 top  (outside the outline)
RESET_SW  58.1,3.49 180 top
SJ1  -46,-127 0 top  (outside the outline)
SJ2  -46,-201 0 top  (outside the outline)
SJ3  -46,-135 0 top  (outside the outline)
SJ4  -46,-206 0 top  (outside the outline)
SJ5  -46,-143 0 top  (outside the outline)
SJ6  -46,-147 0 top  (outside the outline)
SJ7  -46,-151 0 top  (outside the outline)
SJ8  -46,-155 0 top  (outside the outline)
SOLAR  -45,-176 0 top  (outside the outline)
SW_BEE_RST  -28,-85 0 top  (outside the outline)
SW_CHARGE_INDICATORS  -65,-225 0 top  (outside the outline)
SW_WAKEUP  45.72,3.49 180 top
T_LIPO_USB  -46,-219 0 top  (outside the outline)
U1  18.1,41.27 90 top
U2  -41,-107 0 top  (outside the outline)
U3  -46,-160 0 top  (outside the outline)
UART1_C1  -68,-308 0 top  (outside the outline)
UART1_C2  75.06,22.73 90 bottom
UART1_C10  95.89,23.11 270 top
UART1_C11  75.06,26.54 90 bottom
UART1_IC2  75.06,25.91 270 top
UART1_L2  95.89,32.13 90 top
UART1_R6  68.39,21.78 180 top
UART1_R7  87.63,22.61 90 top
UART1_R10  85.09,22.61 90 top
UART1_RX_LED  87.63,26.42 0 top
UART1_TX_LED  85.09,26.42 0 top
USB_CONNECTOR  92,11 180 top
XBEE_SOCKET  -20,-63 0 top  (outside the outline)

### Tracks (layer width: path | path; a pad name or v marks a point on that pad's centre or on a via)
+3V3  (via drill 0.6)  (12 unrouted)
  Top 0.406: 76.92,24.93 v76.71,25.15 75.18,25.15 75.18,27.43 74.43,28.18 | 63.69,15.88 64.01,15.56 | v49.85,20.64 50.32,20.47 ATMEGA1284P-AU.5 53.51,20.47 54.29,19.68 54.29,16.51 55.88,14.92 59.37,14.92 60.96,13.34 61.28,13.34 64.01,13.34 | ATMEGA1284P-AU.38 45.24,16.68 v45.09,16.83 | ATMEGA1284P-AU.27 42.08,22.07 42.23,22.23 v42.23,24.77 | ATMEGA1284P-AU.17 v46.04,25.08
  Top 0.61: R_RESET.2 56.2,8.68 | 39.37,37.15 I2C.1 v39.37,27.62 | R3.2 R4.2 39.3,41.59 39.3,43.75 42.86,47.31 43.81,47.31 51.75,47.31 ISP1.2 | 28.45,29.09 v28.26,28.89
  Top 0.813: 75.18,25.15 75.18,19.84
  Top 1.016: 64.01,10.41 64.01,13.34 64.01,15.56 64.01,16 65.47,17.46 66.67,17.46 67.31,18.1 67.31,19.84 | 67.31,19.84 75.18,19.84 81.82,19.84 83.73,21.76 UART1_R10.1 UART1_R7.1 89.07,21.76 90.14,22.84 | 39.37,37.15 R3.2 | UART1_R6.2 67.31,21.78 67.31,19.84 | v33.34,6.03 33.34,11.75 32.07,13.02 30.16,14.92 v30.16,19.37 | v28.26,28.89 29.21,28.89 31.75,26.35 36.2,26.35 37.15,27.3 37.47,27.62 v39.37,27.62
  Bottom 0.406: v76.71,25.15 76.26,25.59 | v49.85,20.64 48.58,21.59 C6.2 | v45.09,16.83 C2.2 45.19,18.1 47.62,18.1 48.48,18.95 C6.2 | v39.37,27.62 39.69,27.62 42.23,25.08 v42.23,24.77 43.71,24.77 C3.2 | C3.2 47.09,23.71 48.26,22.54 48.26,21.8 C6.2 | v46.04,25.08 46.04,24.98 C3.2
  Bottom 0.61: 25.72,26.99 26.04,26.99 | 27.3,27.94 v28.26,28.89
  Bottom 0.813: 74.93,2.54 76.2,3.81
  Bottom 1.016: 74.93,2.54 68.33,2.54 67.02,3.84 | 67.02,3.84 66.8,4.06 | Q7.2 26.66,1.59 28.89,1.59 31.15,3.84 33.34,3.84 | 33.34,3.84 67.02,3.84 | Q5.2 3.24,30.1 6.35,26.99 25.72,26.99 25.72,23.81 v30.16,19.37 | 26.04,26.99 26.35,26.99 27.3,27.94 v28.26,28.89 | 33.34,3.84 v33.34,6.03
+5V  (9 unrouted)
AREF  (1 unrouted)
  Top 0.406: ATMEGA1284P-AU.29 36.78,20.47 C7.2
BEE_DTR  (1 unrouted)
BEE_RESET  (8 unrouted)
BEE_RESET_SIGNAL  (via drill 0.6)
  Top 0.61: v38.42,8.89 40.64,8.89 41.27,9.53 42.04,10.29
  Bottom 0.61: R8.1 36.83,8.89 v38.42,8.89
BEE_STATUS  (3 unrouted)
BEE_VCC  (7 unrouted)
BEE_VCC_SIGNAL  (via drill 0.6)
  Top 0.61: v28.26,3.49 30.16,3.49 31.43,3.49 34.61,3.49 35.56,4.45 35.56,11.43 38.42,14.29 38.42,16.19 39.5,17.27
  Bottom 0.61: Q7.1 26.66,3.49 v28.26,3.49
FTDI_CTS  (5 unrouted)
FTDI_DTR  (6 unrouted)
  Top 0.406: UART1_IC2.2 71.4,29.45 67.82,29.45
FTDI_RTS  (4 unrouted)
GND  (via drill 0.6)  (51 unrouted)
  Top 0.254: 46.04,17.14 47.94,17.14 48.45,16.64 50.8,16.64 51.31,16.13 52.07,16.13 52.45,15.75 52.45,13.34 50.8,11.68 50.8,4.83 48.9,2.92 48.9,1.27 49.02,1.14 49.02,1.27
  Top 0.406: UART1_IC2.26 78.68,28.48 UART1_IC2.25 78.49,28.45 v76.83,28.45 | v76.71,23.62 UART1_IC2.18 80.02,23.63 80.52,24.13 80.52,24.89 79.83,25.58 UART1_IC2.21 | v93.98,21.84 95.56,21.84 UART1_C10.2 | UART1_IC2.7 73.33,26.23 v73.41,26.16 | ATMEGA1284P-AU.39 46.04,17.14 46.04,17.46 45.72,17.78 v43.5,17.78 | I2C.4 46.99,32.7 45.24,30.95 ATMEGA1284P-AU.18 45.24,25.87 43.18,23.81 43.18,21.91 v42.55,21.27 ATMEGA1284P-AU.28 38.42,21.27 37.25,22.44 C7.1 | ATMEGA1284P-AU.6 53.98,21.27 55.24,20 55.24,18.41 55.56,18.1 63.82,18.1 | 26.97,19.23 26.89,19.23 26.87,19.25
  Top 0.61: v2.86,40.32 3.36,40.83 U1.GND3
  Top 0.813: U1.GND3 5.4,39.98 5.4,38.1 5.66,37.84 U1.6 15.24,37.78 15.24,37.52 20.65,37.52 | 1.44,25.57 U1.GND1 | ISP1.6 51.12,41.59 48.26,41.59 46.99,40.32 I2C.4
  Top 1: 22.5,7 23.07,6.42 C8.2
  Top 1.016: 78.68,28.48 81.57,28.48 83.84,30.76 | 23.07,4.47 C8.2 | 22.5,8.25 22.5,9.8 v22.54,9.84 | v1.59,30.48 1.59,29.64 U1.GND1 4.39,26.84 17.56,26.84 18.59,25.81 | 15.53,38.08 15.24,37.78 | 69.34,2.98 67.59,1.23 RESET_SW.1 RESET_SW.2 52.07,1.23 C16.1 | C9.1 61.27,22.54 | 61.27,22.54 C1.1 | v65.72,22.54 63.82,22.54 | 63.82,22.54 61.27,22.54 | v61.91,15.24 61.91,16.19 63.82,18.1 63.82,22.54 | 25,19.25 26.87,19.25 30.06,22.44 C7.1 | v26.97,12.55 26.97,19.23 | R6.1 18.59,25.81 | 22.5,21.25 23.18,21.93 23.18,24.76 23.18,24.77 22.14,25.81 18.59,25.81 | v2.79,46.23 2.79,47.5
  Bottom 0.406: UART1_C11.2 75.95,28.45 v76.83,28.45 | UART1_C2.2 75.12,23.62 v76.71,23.62 77.98,23.62 80.77,20.83 82.8,20.83 83.79,21.81 94.01,21.81 v93.98,21.84 | 45.3,19.68 C2.1 44.13,19.9 | 44.03,21.27 C3.1 46.35,22.01 C6.1 | 44.03,21.27 v42.55,21.27 | v43.5,17.78 43.18,18.1 43.18,19.37 43.71,19.9 44.13,19.9 | 44.03,21.27 44.03,20 44.13,19.9
  Bottom 0.61: 2.96,39.16 2.86,39.27
  Bottom 0.813: C10.2 v26.97,12.55 29.68,12.55 31.11,11.11 Q6.3
  Bottom 1.016: 73.41,24.38 v73.41,26.16 73.41,26.92 73.97,27.49 UART1_C11.2 | 73.41,24.38 74.17,23.62 75,23.62 UART1_C2.2 | v22.54,9.84 22.54,10.7 C10.2 | 2.86,39.27 v2.86,40.32 2.79,40.39 v2.79,46.23 | v1.59,30.48 1.59,37.78 2.96,39.16 | 73.41,24.38 71.56,22.54 v65.72,22.54 | 63.62,8.89 61.28,8.89 60.33,9.84 60.33,13.65 v61.91,15.24
  other vias: 28,24 35,24 30,36 31,42 13,36 24,36 45,42 38,1 25,20 15,11 3,16 55,35
  pour Top (isolate 0.406, rank 6): 0,0 0,50 100,50 100,0
  pour Bottom (isolate 0.406, rank 6): 0,0 100,0 100,50 0,50
MCU_RST  (via drill 0.6)  (3 unrouted)
  Top 0.406: v49.85,23.5 49.53,23.5 48.9,22.86 48.9,20.32 49.54,19.67 ATMEGA1284P-AU.4 52.72,19.67 53.34,19.05 53.34,13.23 R_RESET.1 | 53.78,29.72 v53.66,29.84
  Top 0.61: RESET_SW.3 RESET_SW.4 53.02,7.58 53.02,9.84 54.51,11.33 R_RESET.1 56.2,12.28
  Top 1.016: C16.2 53.16,5.75 RESET_SW.4
  Bottom 0.406: v49.85,23.5 51.44,23.5 51.75,23.81 51.75,29.84 | 51.75,29.84 51.75,39.05 50.48,40.32 ISP1.5 | v53.66,29.84 51.75,29.84
N$1
  Top 1.016: UART1_R10.2 UART1_TX_LED.A
N$2  (via drill 0.6)
  Top 0.406: UART1_IC2.17 77.34,22.98 v76.71,22.35
  Bottom 0.406: v76.71,22.35 76.14,21.78 UART1_C2.1
N$3  (1 unrouted)
N$4  (via drill 0.6)  (1 unrouted)
  Top 0.406: v81.03,23.11 80.25,22.33 UART1_IC2.16
  Bottom 0.406: 81.68,23.76 v81.03,23.11
N$5  (1 unrouted)
N$7  (1 unrouted)
N$8  (1 unrouted)
N$9
  Top 1.016: UART1_R7.2 UART1_RX_LED.A
N$10  (via drill 0.6)  (1 unrouted)
  Top 0.406: v82.04,22.1 81.63,21.68 UART1_IC2.15
  Bottom 0.406: 83.06,23.11 v82.04,22.1
N$11
  Top 0.406: UART1_IC2.14 69.34,21.68 UART1_R6.1
N$12  (via drill 0.6)  (1 unrouted)
  Top 0.406: v93.73,24.64 93.98,24.38 95.56,24.38 UART1_C10.1
  Top 1.016: 95.76,24 UART1_C10.1 95.75,24.2 95.75,24.41 95.89,24.55 UART1_L2.1
  Bottom 0.406: 93.95,24.41 v93.73,24.64
N$13
  Top 0.406: UART1_IC2.23 82.25,26.88 83.82,28.45 86.65,28.45 UART1_RX_LED.C
N$14
  Top 0.406: UART1_IC2.22 82.62,26.23 83.57,27.18 83.85,27.47 UART1_TX_LED.C
N$15  (1 unrouted)
N$16  (3 unrouted)
N$18  (2 unrouted)
N$20  (2 unrouted)
N$22  (1 unrouted)
N$31  (via drill 0.6)  (1 unrouted)
  Top 0.61: U1.4 6.05,35.63 | 6.05,35.63 5.64,35.63 v5.4,35.88 | 6.05,35.63 3.42,35.63 1.91,37.15 1.27,37.78 1.27,41.27 5.08,45.09 C5.1
  Bottom 0.61: 4.13,34.56 4.13,35.24 4.76,35.88 3.71,36.93
  Bottom 0.813: v5.4,35.88 4.76,35.88 | 4.13,34.56 Q5.3 | 3.71,36.93 C4.1
N$33  (via drill 0.6)
  Top 0.61: v5.71,30.16 7.62,28.26 13.65,28.26 15.24,28.26 16.19,29.21 | 16.19,29.21 17.89,29.21 R6.2 | v13.25,30.08 15.32,30.08 16.19,29.21
  Top 0.813: 20.38,28.92 R5.1
  Top 1.016: R5.1 18.04,29.25 R6.2
  Bottom 0.61: 5.31,32.3 6.99,33.97 6.99,37.47 8.26,38.73 9.33,38.73 | v13.25,30.08 12.7,30.08 v13.25,30.08 | v13.25,30.08 14.29,31.11 14.35,31.18 | v5.71,30.16 5.14,30.74 Q5.1
  Bottom 0.813: Q5.1 5.31,32.3
N$34
  Bottom 1.016: Q6.1 32.09,8.76 R8.2
PA0  (1 unrouted)
PA1  (1 unrouted)
PA2  (1 unrouted)
PA3  (1 unrouted)
PA4_V_SOLAR  (3 unrouted)
PA5_V_LIPO  (5 unrouted)
PA6  (1 unrouted)
PA7  (1 unrouted)
PB0  (2 unrouted)
PB1_INT_BUTTON  (1 unrouted)
PB4_SS  (via drill 0.6)  (1 unrouted)
  Top 0.406: ATMEGA1284P-AU.44 50.27,15.24 v51.12,15.24
  Bottom 0.406: v51.12,15.24 50.8,15.56 40.96,15.56 39.05,17.46 39.05,23.81 32.38,30.48 32.38,35.56 32.38,36.83 31.43,37.78 29.84,37.78 24.45,37.78 23.5,38.73
  Bottom 0.61: 23.33,38.9 23.5,38.73
PB5_MOSI  (via drill 0.6)  (1 unrouted)
  Top 0.406: ATMEGA1284P-AU.1 48.77,17.27 46.99,19.05 46.99,24.77 v47.31,25.08
  Bottom 0.406: ISP1.4 51.75,44.77 49.21,44.77 48.58,44.13 46.99,44.13 46.99,38.42 49.85,35.56 49.85,26.35 49.53,26.04 48.26,26.04 v47.31,25.08
PB6_MISO  (via drill 0.6)  (1 unrouted)
  Top 0.406: ATMEGA1284P-AU.2 48.92,18.07 47.62,19.37 47.62,24.13 v48.58,25.08 | v49.85,37.15 49.85,38.1 52.07,40.32 52.7,40.96 54.29,40.96 55.24,41.91 v55.24,44.77
  Bottom 0.406: v48.58,25.08 50.16,25.08 50.48,25.4 50.48,36.51 v49.85,37.15 | ISP1.1 51.12,48.58 52.39,47.31 54.61,47.31 55.24,46.67 v55.24,44.77
PB7_SCK  (via drill 0.6)  (1 unrouted)
  Top 0.406: ATMEGA1284P-AU.3 49.39,18.87 48.26,20 48.26,23.5 v48.58,23.81 | v48.26,42.86 48.26,45.72 48.58,46.04 ISP1.3
  Bottom 0.406: 12.32,46.67 41.59,46.67 42.23,46.04 ISP1.3 | v48.58,23.81 49.21,24.45 50.48,24.45 51.12,25.08 51.12,37.78 48.26,40.64 v48.26,42.86
PC0_I2C_SDL  (4 unrouted)
  Top 0.406: ATMEGA1284P-AU.19 44.44,34.28
PC1_I2C_SDA  (4 unrouted)
  Top 0.406: ATMEGA1284P-AU.20 43.64,30.98 41.91,32.7
PC2_SD_OFF  (1 unrouted)
  Top 0.406: 42.84,26.01 42.55,25.72 41.59,25.72 40.96,26.35 39.05,26.35 37.78,25.08 30.16,25.08 26,29.25 R5.2
PC3_SD_CD  (3 unrouted)
  Top 0.813: U1.CD1 20.94,39.23
PC4_!DONE  (3 unrouted)
PC5_!CHRG  (3 unrouted)
PD0_RXD0_USB  (7 unrouted)
PD1_TXD0_USB  (via drill 0.6)  (8 unrouted)
  Top 0.406: ATMEGA1284P-AU.10 53.05,24.47 53.34,24.77 53.34,26.99 54.61,28.26 65.41,28.26 65.72,28.57 | 65.72,28.57 65.72,30.48 66.36,31.11 68.9,31.11 69.85,30.16 71.4,30.16 | 65.72,28.57 arc60 v66.04,28.57
  Bottom 0.406: 21.91,13.97 22.86,14.92 33.34,14.92 38.42,9.84 54.61,9.84 64.45,19.68 64.45,23.18 66.04,24.77 v66.04,28.57
PD2_RXD1/MISO  (via drill 0.6)  (2 unrouted)
  Top 0.406: v10.16,47.31 10.48,47.62 21.59,47.62 35.56,47.62 37.15,46.04 37.15,40.32 v37.15,38.1 | ATMEGA1284P-AU.11 52.26,25.27 52.39,25.4 52.39,28.57 49.53,31.43 v47.62,31.43
  Bottom 0.406: 9.65,45.53 10.16,46.04 v10.16,47.31 | v47.62,31.43 38.1,31.43 37.15,32.38 v37.15,38.1
PD3_TXD1/MOSI  (via drill 0.6)  (2 unrouted)
  Top 0.406: v17.14,42.55 19.05,44.77 32.7,44.77 35.24,42.23 35.24,40.32 35.24,32.07 36.83,30.48 v37.47,30.48 | ATMEGA1284P-AU.12 50.04,29.66 49.21,30.48 v48.9,30.48
  Bottom 0.406: 16.32,41.08 17.14,41.91 v17.14,42.55 | v48.9,30.48 38.1,30.48 v37.47,30.48
PD4_XCK1/SCK  (via drill 0.6)  (2 unrouted)
  Top 0.406: v17.78,45.4 18.41,46.04 33.66,46.04 36.2,43.5 36.2,40.32 36.2,37.15 | ATMEGA1284P-AU.13 49.24,28.87 v48.9,29.21 | 36.2,37.15 36.2,36.83 | v36.2,32.38 36.2,37.15
  Bottom 0.406: 13.13,43.29 13.65,43.81 13.65,44.77 14.29,45.4 v17.78,45.4 | v48.9,29.21 48.58,29.53 38.1,29.53 36.51,29.53 36.2,29.84 v36.2,32.38
PD5_CS  (via drill 0.6)  (2 unrouted)
  Top 0.406: ATMEGA1284P-AU.14 48.44,28.08 48.26,28.26 47.94,28.57 v47.31,28.57 | v21.27,42.86 21.59,43.18 21.91,43.5 32.07,43.5 33.97,41.59 34.29,41.27 34.29,40.96 | 34.29,40.96 34.29,40.32 | v34.29,30.48 34.29,40.96
  Bottom 0.406: v47.31,28.57 38.1,28.57 36.2,28.57 v34.29,30.48 | 20.36,41.95 20.95,42.55 v21.27,42.86
PD6  (1 unrouted)
PD7  (2 unrouted)
V_LIPO  (5 unrouted)
V_LIPO_USB  (6 unrouted)
V_SOLAR  (1 unrouted)
VIN  (5 unrouted)
XTAL1
  Top 0.406: C1.2 Q1.1 53.99,22.87 ATMEGA1284P-AU.8
XTAL2
  Top 0.406: C9.2 Q1.2 54.13,22.07 ATMEGA1284P-AU.7

### Text on the board
tNames: Bottl(e)mail v1 / Technische Informatik / Universität Leipzig 2013 | "Hottie"